# Altium schematic sheet MainMaster.SchDoc
size A3; PageSetup: Record=PageOptions|CenterHorizontal=True|CenterVertical=True|PrintScale=0.71|XCorrection=1.00|YCorrection=1.00|PrintKind=0|BorderSize=5000000|LeftOffset=0|BottomOffset=0|Orientation=2|PaperLength=1000|PaperWidth=1000|Scale=100|PaperSource=7|PrintQuality=-4|MediaType=1|DitherType=10|PrintScaleMode=1|PaperKind=A4|PaperIndex=9
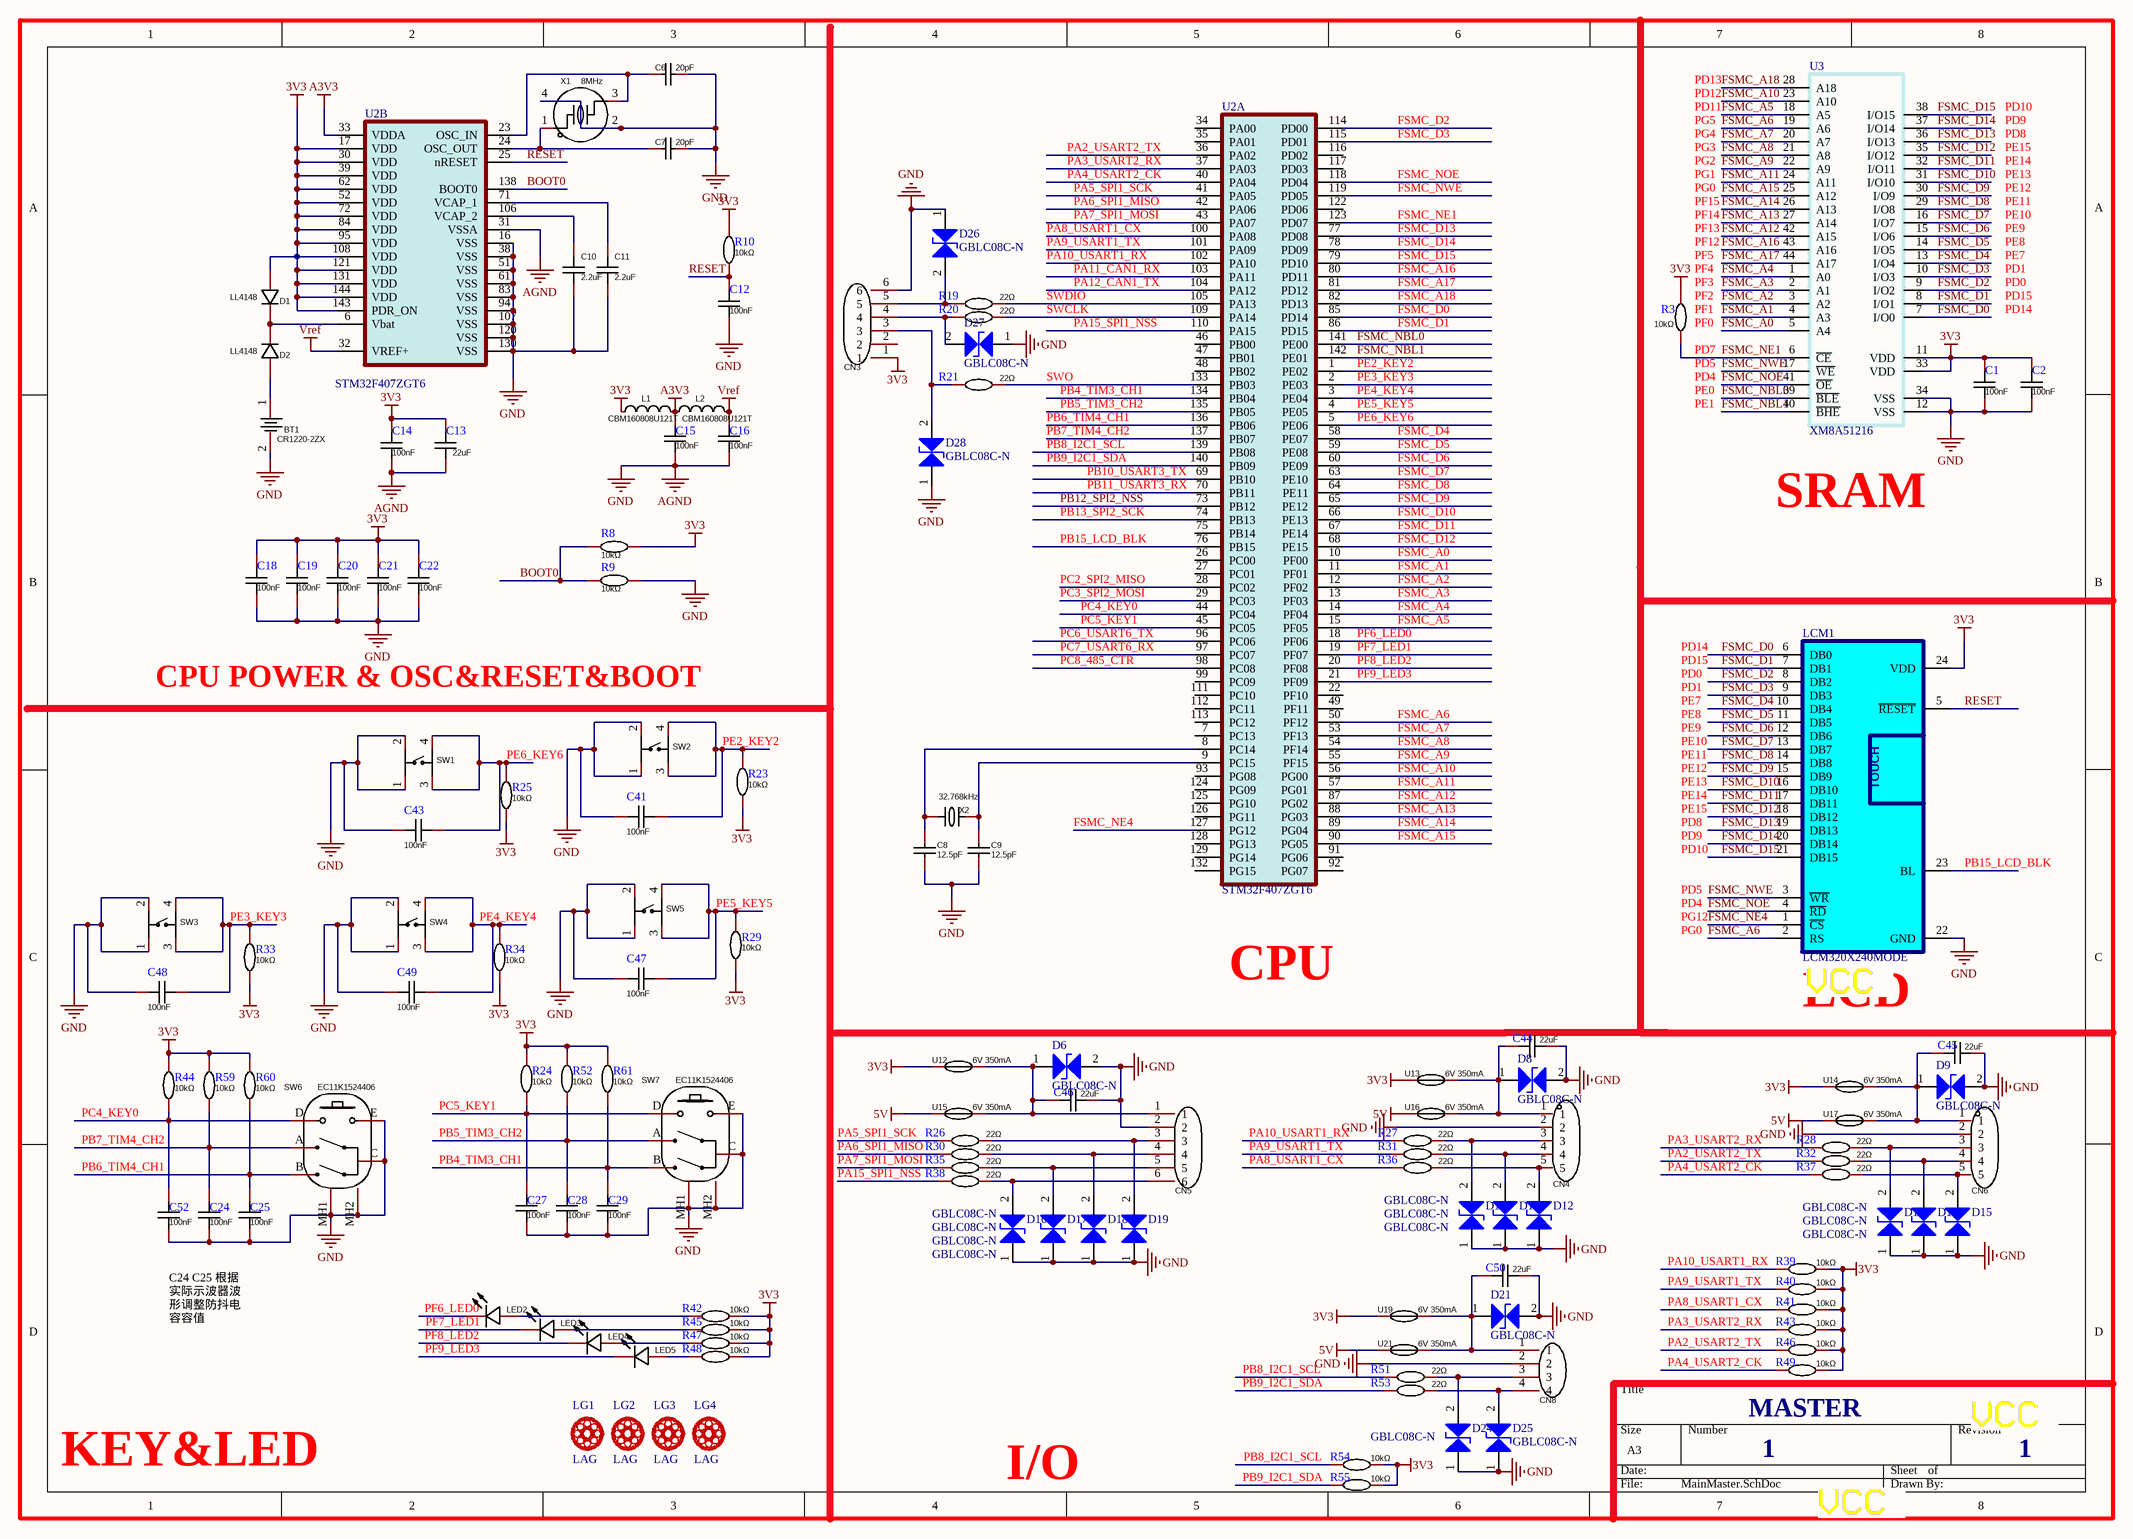
[diagram p0: MainMaster.SchDoc]

## Parts
BT1  CR1220-2ZX  [LI1220_1]
C1  Name: 100nF  [C0603]  (hidden comment: CC0603KRX7R9BB104)
C2  Name: 100nF  [C0603]  (hidden comment: CC0603KRX7R9BB104)
C6  Name: 20pF  [C0603]  (hidden comment: CC0603JRNPO9BN200)
C7  Name: 20pF  [C0603]  (hidden comment: CC0603JRNPO9BN200)
C8  Name: 12.5pF  [C0603]  (hidden comment: CC0603JRNPO9BN200)
C9  Name: 12.5pF  [C0603]  (hidden comment: CC0603JRNPO9BN200)
C10  Name: 2.2uF  [C0603]  (hidden comment: CL10A225KA8NNNC)
C11  Name: 2.2uF  [C0603]  (hidden comment: CL10A225KA8NNNC)
C12  Name: 100nF  [C0603]  (hidden comment: CC0603KRX7R9BB104)
C13  Name: 22uF  [C1210]  (hidden comment: CC0603KRX7R9BB104)
C14  Name: 100nF  [C0603]  (hidden comment: CC0603KRX7R9BB104)
C15  Name: 100nF  [C0603]  (hidden comment: CC0603KRX7R9BB104)
C16  Name: 100nF  [C0603]  (hidden comment: CC0603KRX7R9BB104)
C18  Name: 100nF  [C0603]  (hidden comment: CC0603KRX7R9BB104)
C19  Name: 100nF  [C0603]  (hidden comment: CC0603KRX7R9BB104)
C20  Name: 100nF  [C0603]  (hidden comment: CC0603KRX7R9BB104)
C21  Name: 100nF  [C0603]  (hidden comment: CC0603KRX7R9BB104)
C22  Name: 100nF  [C0603]  (hidden comment: CC0603KRX7R9BB104)
C24  Name: 100nF  [C0603]  (hidden comment: CC0603KRX7R9BB104)
C25  Name: 100nF  [C0603]  (hidden comment: CC0603KRX7R9BB104)
C27  Name: 100nF  [C0603]  (hidden comment: CC0603KRX7R9BB104)
C28  Name: 100nF  [C0603]  (hidden comment: CC0603KRX7R9BB104)
C29  Name: 100nF  [C0603]  (hidden comment: CC0603KRX7R9BB104)
C41  Name: 100nF  [C0603]  (hidden comment: CC0603KRX7R9BB104)
C43  Name: 100nF  [C0603]  (hidden comment: CC0603KRX7R9BB104)
C44  Name: 22uF  [C1210]  (hidden comment: CC0603KRX7R9BB104)
C45  Name: 22uF  [C1210]  (hidden comment: CC0603KRX7R9BB104)
C46  Name: 22uF  [C1210]  (hidden comment: CC0603KRX7R9BB104)
C47  Name: 100nF  [C0603]  (hidden comment: CC0603KRX7R9BB104)
C48  Name: 100nF  [C0603]  (hidden comment: CC0603KRX7R9BB104)
C49  Name: 100nF  [C0603]  (hidden comment: CC0603KRX7R9BB104)
C50  Name: 22uF  [C1210]  (hidden comment: CC0603KRX7R9BB104)
C52  Name: 100nF  [C0603]  (hidden comment: CC0603KRX7R9BB104)
CN3  XH-6A  [XH2.5-6P]  (value not drawn)
CN4  XH-5A  [XH2.5-5P]  (value not drawn)
CN5  XH-6A  [XH2.5-6P]  (value not drawn)
CN6  XH-5A  [XH2.5-5P]  (value not drawn)
CN8  XH-4A  [XH2.5-4P]  (value not drawn)
D1  Name: LL4148  [MINI_MELF (LL34)]  (hidden comment: LL4148_C84135)
D2  Name: LL4148  [MINI_MELF (LL34)]  (hidden comment: LL4148_C84135)
D6  GBLC08C-N  [SOD-323_L1.8-W1.3-LS2.5-BI]
D8  GBLC08C-N  [SOD-323_L1.8-W1.3-LS2.5-BI]
D9  GBLC08C-N  [SOD-323_L1.8-W1.3-LS2.5-BI]
D10  GBLC08C-N  [SOD-323_L1.8-W1.3-LS2.5-BI]
D11  GBLC08C-N  [SOD-323_L1.8-W1.3-LS2.5-BI]
D12  GBLC08C-N  [SOD-323_L1.8-W1.3-LS2.5-BI]
D13  GBLC08C-N  [SOD-323_L1.8-W1.3-LS2.5-BI]
D14  GBLC08C-N  [SOD-323_L1.8-W1.3-LS2.5-BI]
D15  GBLC08C-N  [SOD-323_L1.8-W1.3-LS2.5-BI]
D16  GBLC08C-N  [SOD-323_L1.8-W1.3-LS2.5-BI]
D17  GBLC08C-N  [SOD-323_L1.8-W1.3-LS2.5-BI]
D18  GBLC08C-N  [SOD-323_L1.8-W1.3-LS2.5-BI]
D19  GBLC08C-N  [SOD-323_L1.8-W1.3-LS2.5-BI]
D21  GBLC08C-N  [SOD-323_L1.8-W1.3-LS2.5-BI]
D24  GBLC08C-N  [SOD-323_L1.8-W1.3-LS2.5-BI]
D25  GBLC08C-N  [SOD-323_L1.8-W1.3-LS2.5-BI]
D26  GBLC08C-N  [SOD-323_L1.8-W1.3-LS2.5-BI]
D27  GBLC08C-N  [SOD-323_L1.8-W1.3-LS2.5-BI]
D28  GBLC08C-N  [SOD-323_L1.8-W1.3-LS2.5-BI]
L1  CBM160808U121T  [L0603]
L2  CBM160808U121T  [L0603]
LCM1  LCM320X240MODE  [LCM2.8 MODE]
LED2  17-21SYGC/S530-E3/TR8  [LED 0805G]  (value not drawn)
LED3  17-21SYGC/S530-E3/TR8  [LED 0805G]  (value not drawn)
LED4  17-21SYGC/S530-E3/TR8  [LED 0805G]  (value not drawn)
LED5  17-21SYGC/S530-E3/TR8  [LED 0805G]  (value not drawn)
LG1  LAG  [LAGVAL]
LG2  LAG  [LAGVAL]
LG3  LAG  [LAGVAL]
LG4  LAG  [LAGVAL]
R3  value 10kΩ  [R0603]  (hidden comment: 0603WAF5113T5E)
R8  value 10kΩ  [R0603]  (hidden comment: 0603WAF5113T5E)
R9  value 10kΩ  [R0603]  (hidden comment: 0603WAF5113T5E)
R10  value 10kΩ  [R0603]  (hidden comment: 0603WAF5113T5E)
R19  value 22Ω  [R0603]  (hidden comment: 0603WAF5113T5E)
R20  value 22Ω  [R0603]  (hidden comment: 0603WAF5113T5E)
R21  value 22Ω  [R0603]  (hidden comment: 0603WAF5113T5E)
R23  value 10kΩ  [R0603]  (hidden comment: 0603WAF5113T5E)
R24  value 10kΩ  [R0603]  (hidden comment: 0603WAF5113T5E)
R25  value 10kΩ  [R0603]  (hidden comment: 0603WAF5113T5E)
R26  value 22Ω  [R0603]  (hidden comment: 0603WAF5113T5E)
R27  value 22Ω  [R0603]  (hidden comment: 0603WAF5113T5E)
R28  value 22Ω  [R0603]  (hidden comment: 0603WAF5113T5E)
R29  value 10kΩ  [R0603]  (hidden comment: 0603WAF5113T5E)
R30  value 22Ω  [R0603]  (hidden comment: 0603WAF5113T5E)
R31  value 22Ω  [R0603]  (hidden comment: 0603WAF5113T5E)
R32  value 22Ω  [R0603]  (hidden comment: 0603WAF5113T5E)
R33  value 10kΩ  [R0603]  (hidden comment: 0603WAF5113T5E)
R34  value 10kΩ  [R0603]  (hidden comment: 0603WAF5113T5E)
R35  value 22Ω  [R0603]  (hidden comment: 0603WAF5113T5E)
R36  value 22Ω  [R0603]  (hidden comment: 0603WAF5113T5E)
R37  value 22Ω  [R0603]  (hidden comment: 0603WAF5113T5E)
R38  value 22Ω  [R0603]  (hidden comment: 0603WAF5113T5E)
R39  value 10kΩ  [R0603]  (hidden comment: 0603WAF5113T5E)
R40  value 10kΩ  [R0603]  (hidden comment: 0603WAF5113T5E)
R41  value 10kΩ  [R0603]  (hidden comment: 0603WAF5113T5E)
R42  value 10kΩ  [R0603]  (hidden comment: 0603WAF5113T5E)
R43  value 10kΩ  [R0603]  (hidden comment: 0603WAF5113T5E)
R44  value 10kΩ  [R0603]  (hidden comment: 0603WAF5113T5E)
R45  value 10kΩ  [R0603]  (hidden comment: 0603WAF5113T5E)
R46  value 10kΩ  [R0603]  (hidden comment: 0603WAF5113T5E)
R47  value 10kΩ  [R0603]  (hidden comment: 0603WAF5113T5E)
R48  value 10kΩ  [R0603]  (hidden comment: 0603WAF5113T5E)
R49  value 10kΩ  [R0603]  (hidden comment: 0603WAF5113T5E)
R51  value 22Ω  [R0603]  (hidden comment: 0603WAF5113T5E)
R52  value 10kΩ  [R0603]  (hidden comment: 0603WAF5113T5E)
R53  value 22Ω  [R0603]  (hidden comment: 0603WAF5113T5E)
R54  value 10kΩ  [R0603]  (hidden comment: 0603WAF5113T5E)
R55  value 10kΩ  [R0603]  (hidden comment: 0603WAF5113T5E)
R59  value 10kΩ  [R0603]  (hidden comment: 0603WAF5113T5E)
R60  value 10kΩ  [R0603]  (hidden comment: 0603WAF5113T5E)
R61  value 10kΩ  [R0603]  (hidden comment: 0603WAF5113T5E)
SW1  KH-6X6X5H-STM  [TSW DIP-12*12*7]  (value not drawn)
SW2  KH-6X6X5H-STM  [TSW DIP-12*12*7]  (value not drawn)
SW3  KH-6X6X5H-STM  [TSW DIP-12*12*7]  (value not drawn)
SW4  KH-6X6X5H-STM  [TSW DIP-12*12*7]  (value not drawn)
SW5  KH-6X6X5H-STM  [TSW DIP-12*12*7]  (value not drawn)
SW6  EC11K1524406  [SW-TH_EC11K1524406]
SW7  EC11K1524406  [SW-TH_EC11K1524406]
U2  STM32F407ZGT6  [STM32F407ZET6_TQFP144]  (parts A,B of 2)
U3  XM8A51216  [IS62WV51216BLL_TSOP44]
U12  LCSC Part Name: 6V 350mA  [F0603]  (hidden comment: 0603L035YR)
U13  LCSC Part Name: 6V 350mA  [F0603]  (hidden comment: 0603L035YR)
U14  LCSC Part Name: 6V 350mA  [F0603]  (hidden comment: 0603L035YR)
U15  LCSC Part Name: 6V 350mA  [F0603]  (hidden comment: 0603L035YR)
U16  LCSC Part Name: 6V 350mA  [F0603]  (hidden comment: 0603L035YR)
U17  LCSC Part Name: 6V 350mA  [F0603]  (hidden comment: 0603L035YR)
U19  LCSC Part Name: 6V 350mA  [F0603]  (hidden comment: 0603L035YR)
U21  LCSC Part Name: 6V 350mA  [F0603]  (hidden comment: 0603L035YR)
X1  Name: 8MHz  [OSC 3225-4P]  (hidden comment: X32258MSB4SI)
X2  Name: 32.768kHz  [CR_3215_32768]  (hidden comment: X321532768KGD2SI)

## Nets
3V3: C1.2 C2.2 C13.2 C14.2 C18.2 C19.2 C20.2 C21.2 C22.2 CN3.1 D1.2(A) L1.1 LCM1.24(VDD) R3.2 R8.2 R10.1 R23.1 R24.2 R25.1 R29.1 R33.1 R34.1 R39.1 R40.1 R41.1 R42.1 R43.1 R44.2 R45.1 R46.1 R47.1 R48.1 R49.1 R52.2 R54.1 R55.1 R59.2 R60.2 R61.2 U2.17(VDD) U2.30(VDD) U2.39(VDD) U2.52(VDD) U2.62(VDD) U2.72(VDD) U2.84(VDD) U2.95(VDD) U2.108(VDD) U2.121(VDD) U2.131(VDD) U2.143(PDR_ON) U2.144(VDD) U3.11(VDD) U3.33(VDD) U12.1 U13.1 U14.1 U19.1
5V: U15.1 U16.1 U17.1 U21.1
A3V3: C15.2 L1.2 L2.1 U2.33(VDDA)
AGND: BT1.2 C1.1 C2.1 C6.2 C7.2 C8.1 C9.1 C10.1 C11.1 C12.1 C13.1 C14.1 C15.1 C16.1 C18.1 C19.1 C20.1 C21.1 C22.1 C24.2 C25.2 C27.2 C28.2 C29.2 C41.2 C43.2 C44.1 C45.1 C46.1 C47.2 C48.2 C49.2 C50.1 C52.2 CN3.6 CN4.2 CN5.2 CN6.2 CN8.2 D6.2(K) D8.2(K) D9.2(K) D10.1(A) D11.1(A) D12.1(A) D13.1(A) D14.1(A) D15.1(A) D16.1(A) D17.1(A) D18.1(A) D19.1(A) D21.2(K) D24.1(A) D25.1(A) D26.1(A) D27.1(A) D28.1(A) LCM1.22(GND) R9.2 SW1.1 SW1.2 SW2.1 SW2.2 SW3.1 SW3.2 SW4.1 SW4.2 SW5.1 SW5.2 SW6.C SW6.E SW6.MH1 SW6.MH2 SW7.C SW7.E SW7.MH1 SW7.MH2 U2.16(VSS) U2.31(VSSA) U2.38(VSS) U2.51(VSS) U2.61(VSS) U2.83(VSS) U2.94(VSS) U2.107(VSS) U2.120(VSS) U2.130(VSS) U3.12(VSS) U3.34(VSS) X1.2(GND) X1.4(GND)  [also labelled GND]
Vref: C16.2 L2.2 U2.32(VREF+)
BOOT0: R8.1 R9.1 U2.138(BOOT0)
FSMC_A0: U2.10(PF00) U3.5(A4)
FSMC_A1: U2.11(PF01) U3.4(A3)
FSMC_A2: U2.12(PF02) U3.3(A2)
FSMC_A3: U2.13(PF03) U3.2(A1)
FSMC_A4: U2.14(PF04) U3.1(A0)
FSMC_A5: U2.15(PF05) U3.18(A5)
FSMC_A6: LCM1.2(RS) U2.50(PF12) U3.19(A6)
FSMC_A7: U2.53(PF13) U3.20(A7)
FSMC_A8: U2.54(PF14) U3.21(A8)
FSMC_A9: U2.55(PF15) U3.22(A9)
FSMC_A10: U2.56(PG00) U3.23(A10)
FSMC_A11: U2.57(PG01) U3.24(A11)
FSMC_A12: U2.87(PG02) U3.42(A15)
FSMC_A13: U2.88(PG03) U3.27(A14)
FSMC_A14: U2.89(PG04) U3.26(A13)
FSMC_A15: U2.90(PG05) U3.25(A12)
FSMC_A16: U2.80(PD11) U3.43(A16)
FSMC_A17: U2.81(PD12) U3.44(A17)
FSMC_A18: U2.82(PD13) U3.28(A18)
FSMC_D0: LCM1.6(DB0) U2.85(PD14) U3.7(I/O0)
FSMC_D1: LCM1.7(DB1) U2.86(PD15) U3.8(I/O1)
FSMC_D2: LCM1.8(DB2) U2.114(PD00) U3.9(I/O2)
FSMC_D3: LCM1.9(DB3) U2.115(PD01) U3.10(I/O3)
FSMC_D4: LCM1.10(DB4) U2.58(PE07) U3.13(I/O4)
FSMC_D5: LCM1.11(DB5) U2.59(PE08) U3.14(I/O5)
FSMC_D6: LCM1.12(DB6) U2.60(PE09) U3.15(I/O6)
FSMC_D7: LCM1.13(DB7) U2.63(PE10) U3.16(I/O7)
FSMC_D8: LCM1.14(DB8) U2.64(PE11) U3.29(I/O8)
FSMC_D9: LCM1.15(DB9) U2.65(PE12) U3.30(I/O9)
FSMC_D10: LCM1.16(DB10) U2.66(PE13) U3.31(I/O10)
FSMC_D11: LCM1.17(DB11) U2.67(PE14) U3.32(I/O11)
FSMC_D12: LCM1.18(DB12) U2.68(PE15) U3.35(I/O12)
FSMC_D13: LCM1.19(DB13) U2.77(PD08) U3.36(I/O13)
FSMC_D14: LCM1.20(DB14) U2.78(PD09) U3.37(I/O14)
FSMC_D15: LCM1.21(DB15) U2.79(PD10) U3.38(I/O15)
FSMC_NBL0: U2.141(PE00) U3.39(~{BLE})
FSMC_NBL1: U2.142(PE01) U3.40(~{BHE})
FSMC_NE1: R3.1 U2.123(PD07) U3.6(~{CE})
FSMC_NE4: LCM1.1(~{CS}) U2.127(PG12)
FSMC_NOE: LCM1.4(~{RD}) U2.118(PD04) U3.41(~{OE})
FSMC_NWE: LCM1.3(~{WR}) U2.119(PD05) U3.17(~{WE})
PA2_USART2_TX: R32.2 R46.2 U2.36(PA02)
PA3_USART2_RX: R28.2 R43.2 U2.37(PA03)
PA4_USART2_CK: R37.2 R49.2 U2.40(PA04)
PA5_SPI1_SCK: R26.2 U2.41(PA05)
PA6_SPI1_MISO: R30.2 U2.42(PA06)
PA7_SPI1_MOSI: R35.2 U2.43(PA07)
PA8_USART1_CX: R36.2 R41.2 U2.100(PA08)
PA9_USART1_TX: R31.2 R40.2 U2.101(PA09)
PA10_USART1_RX: R27.2 R39.2 U2.102(PA10)
PA11_CAN1_RX: U2.103(PA11)
PA12_CAN1_TX: U2.104(PA12)
PA15_SPI1_NSS: R38.2 U2.110(PA15)
PB4_TIM3_CH1: C29.1 R61.1 SW7.B U2.134(PB04)
PB5_TIM3_CH2: C28.1 R52.1 SW7.A U2.135(PB05)
PB6_TIM4_CH1: C25.1 R60.1 SW6.B U2.136(PB06)
PB7_TIM4_CH2: C24.1 R59.1 SW6.A U2.137(PB07)
PB8_I2C1_SCL: R51.2 R54.2 U2.139(PB08)
PB9_I2C1_SDA: R53.2 R55.2 U2.140(PB09)
PB10_USART3_TX: U2.69(PB10)
PB11_USART3_RX: U2.70(PB11)
PB12_SPI2_NSS: U2.73(PB12)
PB13_SPI2_SCK: U2.74(PB13)
PB15_LCD_BLK: LCM1.23(BL) U2.76(PB15)
PC2_SPI2_MISO: U2.28(PC02)
PC3_SPI2_MOSI: U2.29(PC03)
PC4_KEY0: C52.1 R44.1 SW6.D U2.44(PC04)
PC5_KEY1: C27.1 R24.1 SW7.D U2.45(PC05)
PC6_USART6_TX: U2.96(PC06)
PC7_USART6_RX: U2.97(PC07)
PC8_485_CTR: U2.98(PC08)
PE2_KEY2: C41.1 R23.2 SW2.3 SW2.4 U2.1(PE02)
PE3_KEY3: C48.1 R33.2 SW3.3 SW3.4 U2.2(PE03)
PE4_KEY4: C49.1 R34.2 SW4.3 SW4.4 U2.3(PE04)
PE5_KEY5: C47.1 R29.2 SW5.3 SW5.4 U2.4(PE05)
PE6_KEY6: C43.1 R25.2 SW1.3 SW1.4 U2.5(PE06)
PF6_LED0: LED2.1(K) U2.18(PF06)
PF7_LED1: LED3.1(K) U2.19(PF07)
PF8_LED2: LED4.1(K) U2.20(PF08)
PF9_LED3: LED5.1(K) U2.21(PF09)
RESET: C12.2 LCM1.5(~{RESET}) R10.2 U2.25(nRESET)
SWCLK: R20.1 U2.109(PA14)
SWDIO: R19.1 U2.105(PA13)
SWO: R21.1 U2.133(PB03)
NetBT1_1: BT1.1 D2.2(A)
NetC6_1: C6.1 U2.23(OSC_IN) X1.3
NetC7_1: C7.1 U2.24(OSC_OUT) X1.1
NetC8_2: C8.2 U2.8(PC14) X2.1
NetC9_2: C9.2 U2.9(PC15) X2.2
NetC10_2: C10.2 U2.106(VCAP_2)
NetC11_2: C11.2 U2.71(VCAP_1)
NetC44_2: C44.2 CN4.1 D8.1(A) U13.2 U16.2
NetC45_2: C45.2 CN6.1 D9.1(A) U14.2 U17.2
NetC46_2: C46.2 CN5.1 D6.1(A) U12.2 U15.2
NetC50_2: C50.2 CN8.1 D21.1(A) U19.2 U21.2
NetCN3_3: CN3.3 D28.2(K) R21.2
NetCN3_4: CN3.4 D27.2(K) R20.2
NetCN3_5: CN3.5 D26.2(K) R19.2
NetCN4_3: CN4.3 D10.2(K) R27.1
NetCN4_4: CN4.4 D11.2(K) R31.1
NetCN4_5: CN4.5 D12.2(K) R36.1
NetCN5_3: CN5.3 D19.2(K) R26.1
NetCN5_4: CN5.4 D18.2(K) R30.1
NetCN5_5: CN5.5 D17.2(K) R35.1
NetCN5_6: CN5.6 D16.2(K) R38.1
NetCN6_3: CN6.3 D13.2(K) R28.1
NetCN6_4: CN6.4 D14.2(K) R32.1
NetCN6_5: CN6.5 D15.2(K) R37.1
NetCN8_3: CN8.3 D24.2(K) R51.1
NetCN8_4: CN8.4 D25.2(K) R53.1
NetD1_1: D1.1(K) D2.1(K) U2.6(Vbat)
NetLED2_2: LED2.2(A) R42.2
NetLED3_2: LED3.2(A) R45.2
NetLED4_2: LED4.2(A) R47.2
NetLED5_2: LED5.2(A) R48.2

Not connected (* = marked no-connect by the designer): CN3 2; LG1 0; LG2 0; LG3 0; LG4 0; U2 7(PC13) 22(PF10) 26(PC00) 27(PC01) 34(PA00) 35(PA01) 46(PB00) 47(PB01) 48(PB02) 49(PF11) 75(PB14) 91(PG06) 92(PG07) 93(PG08) 99(PC09) 111(PC10) 112(PC11) 113(PC12) 116(PD02) 117(PD03) 122(PD06) 124(PG09) 125(PG10) 126(PG11) 128(PG13) 129(PG14) 132(PG15)

## Notes on the sheet
- PG5
- PD11
- PD12
- PD13
- PD9
- PD10
- PG0
- PG1
- PG2
- PG3
- PG4
- PE12
- PE13
- PE14
- PE15
- PD8
- (near R3) PF5
- PF12
- PF13
- PF14
- PF15
- PE7
- PE8
- PE9
- PE10
- PE11
- (near R3) PF0
- (near R3) PF1
- (near R3) PF2
- (near R3) PF3
- (near R3) PF4
- PD14
- PD15
- PD0
- PD1
- (near R3) PD7
- (near R3) PD5
- (near R3) PD4
- PE0
- PE1
- (near U3) SRAM
- CPU POWER & OSC&RESET&BOOT
- PD5
- PD4
- PG12
- CPU
- (near LCM1) LCD
- C24 C25 根据实际示波器波形调整防抖电容容值
- KEY&LED
- (near R49) MASTER
- 1
- I/O
- (in symbol LCM320X240MODE) TOUCH

## Library data of the parts
BT1 = CR1220-2ZX: Manufacturer: Q&J; Add into BOM: yes; Connector Type: 电池底座; Battery Type: CR1220; Name: CR1220-2ZX; Symbol: CR1220-2ZX; Device: CR1220-2ZX; LCSC Part Name: 电池底座 适用电池:CR1220 自吸; Supplier Part: C969906; Manufacturer Part: CR1220-2ZX; Supplier Footprint: SMD; JLCPCB Part Class: Extended Part; Datasheet: https://atta.szlcsc.com/upload/public/pdf/source/20210107/C969906_C1D85B5C66CBBA4D1AEB8467FE1CEC7A.pdf; Supplier: LCSC; Convert to PCB: yes; Operating Temperature Range: -25℃~+85℃
C1 C2 C12 C14-C16 C18-C22 C24 C25 C27-C29 C41 C43 C47-C49 C52 = CC0603KRX7R9BB104: Manufacturer: YAGEO(国巨); Add into BOM: yes; Value: 100nF; Tolerance: ±10%; Voltage Rated: 50V; Temperature Coefficient: X7R; Symbol: CC0603KRX7R9BB104; Device: CC0603KRX7R9BB104; LCSC Part Name: 100nF ±10% 50V; Supplier Part: C14663; Manufacturer Part: CC0603KRX7R9BB104; Supplier Footprint: 0603; JLCPCB Part Class: Basic Part; Datasheet: https://atta.szlcsc.com/upload/public/pdf/source/20170116/1484561234239.pdf; Supplier: LCSC; Convert to PCB: yes
C6 C7 = CC0603JRNPO9BN200: Manufacturer: YAGEO(国巨); Add into BOM: yes; Value: 20pF; Tolerance: ±5%; Voltage Rated: 50V; Temperature Coefficient: NP0; Symbol: CC0603JRNPO9BN200; Device: CC0603JRNPO9BN200; LCSC Part Name: 20pF ±5% 50V; Supplier Part: C105621; Manufacturer Part: CC0603JRNPO9BN200; Supplier Footprint: 0603; JLCPCB Part Class: Extended Part; Datasheet: https://atta.szlcsc.com/upload/public/pdf/source/20170425/1493115771885.pdf; Supplier: LCSC; Convert to PCB: yes
C8 C9 = CC0603JRNPO9BN200: Manufacturer: YAGEO(国巨); Add into BOM: yes; Value: 12.5pF; Tolerance: ±5%; Voltage Rated: 50V; Temperature Coefficient: NP0; Symbol: CC0603JRNPO9BN200; Device: CC0603JRNPO9BN200; LCSC Part Name: 12.5pF ±5% 50V; Supplier Part: C105621; Manufacturer Part: CC0603JRNPO9BN200; Supplier Footprint: 0603; JLCPCB Part Class: Extended Part; Datasheet: https://atta.szlcsc.com/upload/public/pdf/source/20170425/1493115771885.pdf; Supplier: LCSC; Convert to PCB: yes
C10 C11 = CL10A225KA8NNNC: Manufacturer: SAMSUNG(三星); Add into BOM: yes; Value: 2.2uF; Tolerance: ±10%; Voltage Rated: 25V; Temperature Coefficient: X5R; Symbol: CL10A225KA8NNNC; Device: CL10A225KA8NNNC; LCSC Part Name: 2.2uF ±10% 25V; Supplier Part: C57895; Manufacturer Part: CL10A225KA8NNNC; Supplier Footprint: 0603; JLCPCB Part Class: Extended Part; Datasheet: https://atta.szlcsc.com/upload/public/pdf/source/20170325/1490427872398.pdf; Supplier: LCSC; Convert to PCB: yes
C13 C44-C46 C50 = CC0603KRX7R9BB104: Manufacturer: YAGEO(国巨); Add into BOM: yes; Value: 22uF; Tolerance: ±10%; Voltage Rated: 50V; Temperature Coefficient: X7R; Symbol: CC0603KRX7R9BB104; Device: CC0603KRX7R9BB104; LCSC Part Name: 22uF ±10% 25V; Supplier Part: C14663; Manufacturer Part: CC0603KRX7R9BB104; Supplier Footprint: 0603; JLCPCB Part Class: Basic Part; Datasheet: https://atta.szlcsc.com/upload/public/pdf/source/20170116/1484561234239.pdf; Supplier: LCSC; Convert to PCB: yes
CN3 CN5 = XH-6A: Manufacturer: BOOMELE(博穆精密); Add into BOM: yes; Reference Series: XH; Pitch: 2.5mm; Pins Structure: 1x6P; Number of PINs Per Row: 6; Name: XH-6A; Symbol: XH-6A; Device: XH-6A; LCSC Part Name: XH-6A,6P,脚距2.5mm,直插 直插; Supplier Part: C5663; Manufacturer Part: XH-6A; Supplier Footprint: 插件,P=2.5mm; JLCPCB Part Class: Extended Part; Datasheet: https://atta.szlcsc.com/upload/public/pdf/source/20151222/1457707648819.pdf; Supplier: LCSC; Convert to PCB: yes; Number of Rows: 1; Row Spacing: -; Mounting Style: -; Contact Material: -
CN4 CN6 = XH-5A: Manufacturer: BOOMELE(博穆精密); Add into BOM: yes; Reference Series: XH; Pitch: 2.5mm; Pins Structure: 1x5P; Number of PINs Per Row: 5; Name: XH-5A; Symbol: XH-5A; Device: XH-5A; LCSC Part Name: XH-5A,5P,脚距2.5mm,直插; Supplier Part: C2318; Manufacturer Part: XH-5A; Supplier Footprint: 插件,P=2.5mm; JLCPCB Part Class: Extended Part; Datasheet: https://atta.szlcsc.com/upload/public/pdf/source/20151222/1457707640907.pdf; Supplier: LCSC; Convert to PCB: yes; Number of Rows: 1; Row Spacing: -; Mounting Style: -; Contact Material: -
CN8 = XH-4A: Manufacturer: BOOMELE(博穆精密); Add into BOM: yes; Reference Series: XH; Pitch: 2.5mm; Pins Structure: 1x4P; Number of PINs Per Row: 4; Name: XH-4A; Symbol: XH-4A; Device: XH-4A; LCSC Part Name: XH-4A,4P,脚距2.5mm,直插 直插; Supplier Part: C37815; Manufacturer Part: XH-4A; Supplier Footprint: 插件,P=2.5mm; JLCPCB Part Class: Extended Part; Datasheet: https://atta.szlcsc.com/upload/public/pdf/source/20170919/C37815_1505787307039977083.pdf; Supplier: LCSC; Convert to PCB: yes; Number of Rows: 1; Row Spacing: -; Mounting Style: -; Contact Material: 磷青铜
D1 D2 = LL4148_C84135: Manufacturer: onsemi(安森美); Add into BOM: yes; Power Dissipation: 500mW; Reverse Voltage (Vr): 100V; Average Rectified Current (Io): 200mA; Forward Voltage (Vf@If): 1V@10mA; Reverse Leakage Current: 25nA@20V; Reverse Recovery Time (trr): 4ns; Symbol: LL4148_C84135; Device: LL4148_C84135; LCSC Part Name: LL4148; Supplier Part: C84135; Manufacturer Part: LL4148; Supplier Footprint: SOD-80; JLCPCB Part Class: Extended Part; Datasheet: https://atta.szlcsc.com/upload/public/pdf/source/20171014/C84135_15079757806671038559.pdf; Supplier: LCSC; Convert to PCB: yes; Diode Configuration: -; Operating Temperature: -55℃~+175℃@(Tj)
D6 D8-D19 D21 D24-D28 = 09.04.00336: LXES1UTAA1-157,0402,MURATA; Manufacturer: BORN伯恩半导体; Add into BOM: yes; Polarity: Bidirectional; Voltage - Reverse Standoff (Typ): 8V (Max); Voltage - Breakdown (Min): 9V; Voltage - Clamping (Max) @ Ipp: 27V; Current - Peak Pulse (10/1000μs): 15A (8/20us); Name: GBLC08C-N; Symbol: GBLC08C-N; Device: GBLC08C-N; LCSC Part Name: GBLC08C-N; Supplier Part: C314256; Manufacturer Part: GBLC08C-N; Supplier Footprint: SOD-323; JLCPCB Part Class: Extended Part; Datasheet: https://atta.szlcsc.com/upload/public/pdf/source/20181015/C314256_034D87A5331B49D4E86F2A48D2519FC5.pdf; Supplier: LCSC; Convert to PCB: yes
L1 L2 = CBM160808U121T: Manufacturer: FH(风华); Add into BOM: yes; Impedance @ Frequency: 120Ω@100MHz; Tolerance: ±25%; DC Resistance: 65mΩ; Current Rating: 2A; Circuits: 1; Name: CBM160808U121T; Symbol: CBM160808U121T; Device: CBM160808U121T; LCSC Part Name: 120Ω@100MHz ±25%; Supplier Part: C62708; Manufacturer Part: CBM160808U121T; Supplier Footprint: 0603; JLCPCB Part Class: Extended Part; Datasheet: https://atta.szlcsc.com/upload/public/pdf/source/20151203/1457707610455.pdf; Supplier: LCSC; Convert to PCB: yes
LED2-LED5 = 17-21SYGC/S530-E3/TR8: Manufacturer: EVERLIGHT(亿光); Add into BOM: yes; Illumination Color: 普绿/黄绿; Luminous Intensity (IF=20mA): 32mcd; Dominant Wavelength / Coordinate rank: 573nm; Name: 17-21SYGC/S530-E3/TR8; Symbol: 17-21SYGC/S530-E3/TR8; Device: 17-21SYGC/S530-E3/TR8; LCSC Part Name: 普绿/黄绿LED，贴片; Supplier Part: C142303; Manufacturer Part: 17-21SYGC/S530-E3/TR8; Supplier Footprint: 0805; JLCPCB Part Class: Extended Part; Datasheet: https://atta.szlcsc.com/upload/public/pdf/source/20171110/C142303_15102792667121104246.pdf; Supplier: LCSC; Convert to PCB: yes; Mounting Type: 表面贴装; Correlated Color Temperature - CCT(K): -; Luminous Flux/Radiant Flux: -
LG1-LG4 = LAGVAL
R3 R8-R10 R19-R21 R23-R49 R51-R55 R59-R61 = 0603WAF5113T5E: Manufacturer: UNI-ROYAL(厚声); Add into BOM: yes; Tolerance: ±1%; Power(Watts): 100mW; Temperature Coefficient: ±100ppm/℃; Overload Voltage (Max): 75V; Symbol: 0603WAF5113T5E; Device: 0603WAF5113T5E; LCSC Part Name: 511kΩ ±1% 100mW; Supplier Part: C23194; Manufacturer Part: 0603WAF5113T5E; Supplier Footprint: 0603; JLCPCB Part Class: Extended Part; Datasheet: https://atta.szlcsc.com/upload/public/pdf/source/20200306/C422600_1E6D84923E4A46A82E41ADD87F860B5C.pdf; Supplier: LCSC; Convert to PCB: yes; Type: 厚膜电阻; Operating Temperature Range: -55℃~+155℃
  R3 R8-R10 R23-R25 R29 R33 R34 R39-R49 R52 R54 R55 R59-R61: Name: 10kΩ
  R19-R21 R26-R28 R30-R32 R35-R38 R51 R53: Name: 22Ω
SW1-SW5 = KH-6X6X5H-STM: Manufacturer: kinghelm(金航标); Add into BOM: yes; Contact Current: 50mA; Voltage Rating (DC): 12V; Circuit: 单刀单掷; Actuator Style: 圆形按钮; Actuator/Cap Color: 黑色; Mechanical Life: 80000; Pin Style: 鸥翼型; Switch Length: 6mm; Switch Height: 5mm; Strike Gundam: 否; Name: KH-6X6X5H-STM; Symbol: KH-6X6X5H-STM; Device: KH-6X6X5H-STM; LCSC Part Name: KH-6X6X5H-STM; Supplier Part: C2837531; Manufacturer Part: KH-6X6X5H-STM; Supplier Footprint: SMD; JLCPCB Part Class: Extended Part; Datasheet: https://atta.szlcsc.com/upload/public/pdf/source/20210608/C2837531_45E87AB996CE723B09405FF2EA209C4C.pdf; Supplier: LCSC; Convert to PCB: yes; Mounting Style: 立贴; Switch Width: 6mm
SW6 SW7 = EC11K1524406: Manufacturer: ALPSALPINE(阿尔卑斯阿尔派); Add into BOM: yes; Name: EC11K1524406; Symbol: EC11K1524406; Device: EC11K1524406; LCSC Part Name: 编码器; Supplier Part: C398934; Manufacturer Part: EC11K1524406; Supplier Footprint: 插件; JLCPCB Part Class: Extended Part; Datasheet: https://atta.szlcsc.com/upload/public/pdf/source/20190620/C398934_DDD5BF6D843226194F24C74B1929B82F.pdf; Supplier: LCSC; Convert to PCB: yes
U2 = STM32F407ZET6: Manufacturer: ST(意法半导体); Add into BOM: yes; CPU Core: ARM Cortex-M4; Maximum Frequency: 168MHZ; Supply Voltage Range: 1.8V~3.6V; Program FLASH Size: 1MB; Internal Oscillator: 有; RAM Size: 192KB; DAC (Units/Channels/bits): 1@x24ch/12bit; ADC (Units/Channels/bits): 1@x2ch/12bit; Peripherals / Functions / Protocol Stacks: 欠压检测/复位；DMA；LCD驱动；看门狗；POR；PWM; GPIO Ports Number: 114; Name: STM32F407ZGT6; Symbol: STM32F407ZGT6; Device: STM32F407ZGT6; LCSC Part Name: C19156; Manufacturer Part: STM32F407ZGT6; Supplier Footprint: LQFP-144_20x20x05P; JLCPCB Part Class: Extended Part; Supplier: LCSC; Convert to PCB: yes; EEPROM/Data FLASH Size: -; Operating Temperature Range: -40℃~+85℃; Datasheet: https://atta.szlcsc.com/upload/public/pdf/source/20140724/1457707162528.pdf
U3 = IS64WV51216BLL-10MA3
U12-U17 U19 U21 = 0603L035YR: Manufacturer: Littelfuse(美国力特); Add into BOM: yes; Operating Voltage (Max): 6V; Current Rating (Max): 40A; Hold Current: 350mA; Trip Current: 750mA; Resistance - Initial (Ri) (Min): 200mΩ; Resistance - Post Trip (R1) (Max): 1Ω; Maximum Time to Trip: 100ms; Name: 0603L035YR; Symbol: 0603L035YR; Device: 0603L035YR; Supplier Part: C207013; Manufacturer Part: 0603L035YR; Supplier Footprint: 0603; JLCPCB Part Class: Extended Part; Datasheet: https://atta.szlcsc.com/upload/public/pdf/source/20180709/C207013_44786F09EAFC890D8A7C29FA56404C7F.pdf; Supplier: LCSC; Convert to PCB: yes; Power Dissipation: -; Operating Temperature: -40℃~+85℃
X1 = X32258MSB4SI: Manufacturer: YXC(扬兴晶振); Add into BOM: yes; Crystal Type: 贴片无源晶振; Value: 8MHz; Frequency Tolerance: ±10ppm; Frequency Stability: ±30ppm; Load Capacitance: 20pF; Symbol: X32258MSB4SI; Device: X32258MSB4SI; LCSC Part Name: 8MHz ±10ppm 20pF; Supplier Part: C2682774; Manufacturer Part: X32258MSB4SI; Supplier Footprint: SMD3225-4P; JLCPCB Part Class: Extended Part; Datasheet: https://atta.szlcsc.com/upload/public/pdf/source/20210106/C2682774_0CD4FDA5D9DA3FBEEC23BD607A48E4B0.pdf; Supplier: LCSC; Convert to PCB: yes; Operating Temperature: -40℃~+85℃
X2 = X321532768KGD2SI: Manufacturer: YXC(扬兴晶振); Add into BOM: yes; Crystal Type: 贴片无源晶振; Value: 32.768kHz; Frequency Tolerance: ±20ppm; Load Capacitance: 12.5pF; Symbol: X321532768KGD2SI; Device: X321532768KGD2SI; LCSC Part Name: YST310S 32.768kHz ±20ppm 12.5pF; Supplier Part: C620155; Manufacturer Part: X321532768KGD2SI; Supplier Footprint: SMD3215-2P; JLCPCB Part Class: Extended Part; Datasheet: https://atta.szlcsc.com/upload/public/pdf/source/20210329/C620155_E5A74FC0D27C5E9015A8D75DE9484FEA.pdf; Supplier: LCSC; Convert to PCB: yes; Operating Temperature: -40℃~+85℃